# EAGLE schematic Domino Single Ethernet No Teardrop (EAGLE 6.5.0)
DATABASE: ./../Common/BOM/Domino_DB.txt; DRAWN: M.STEMPIN; REV: C
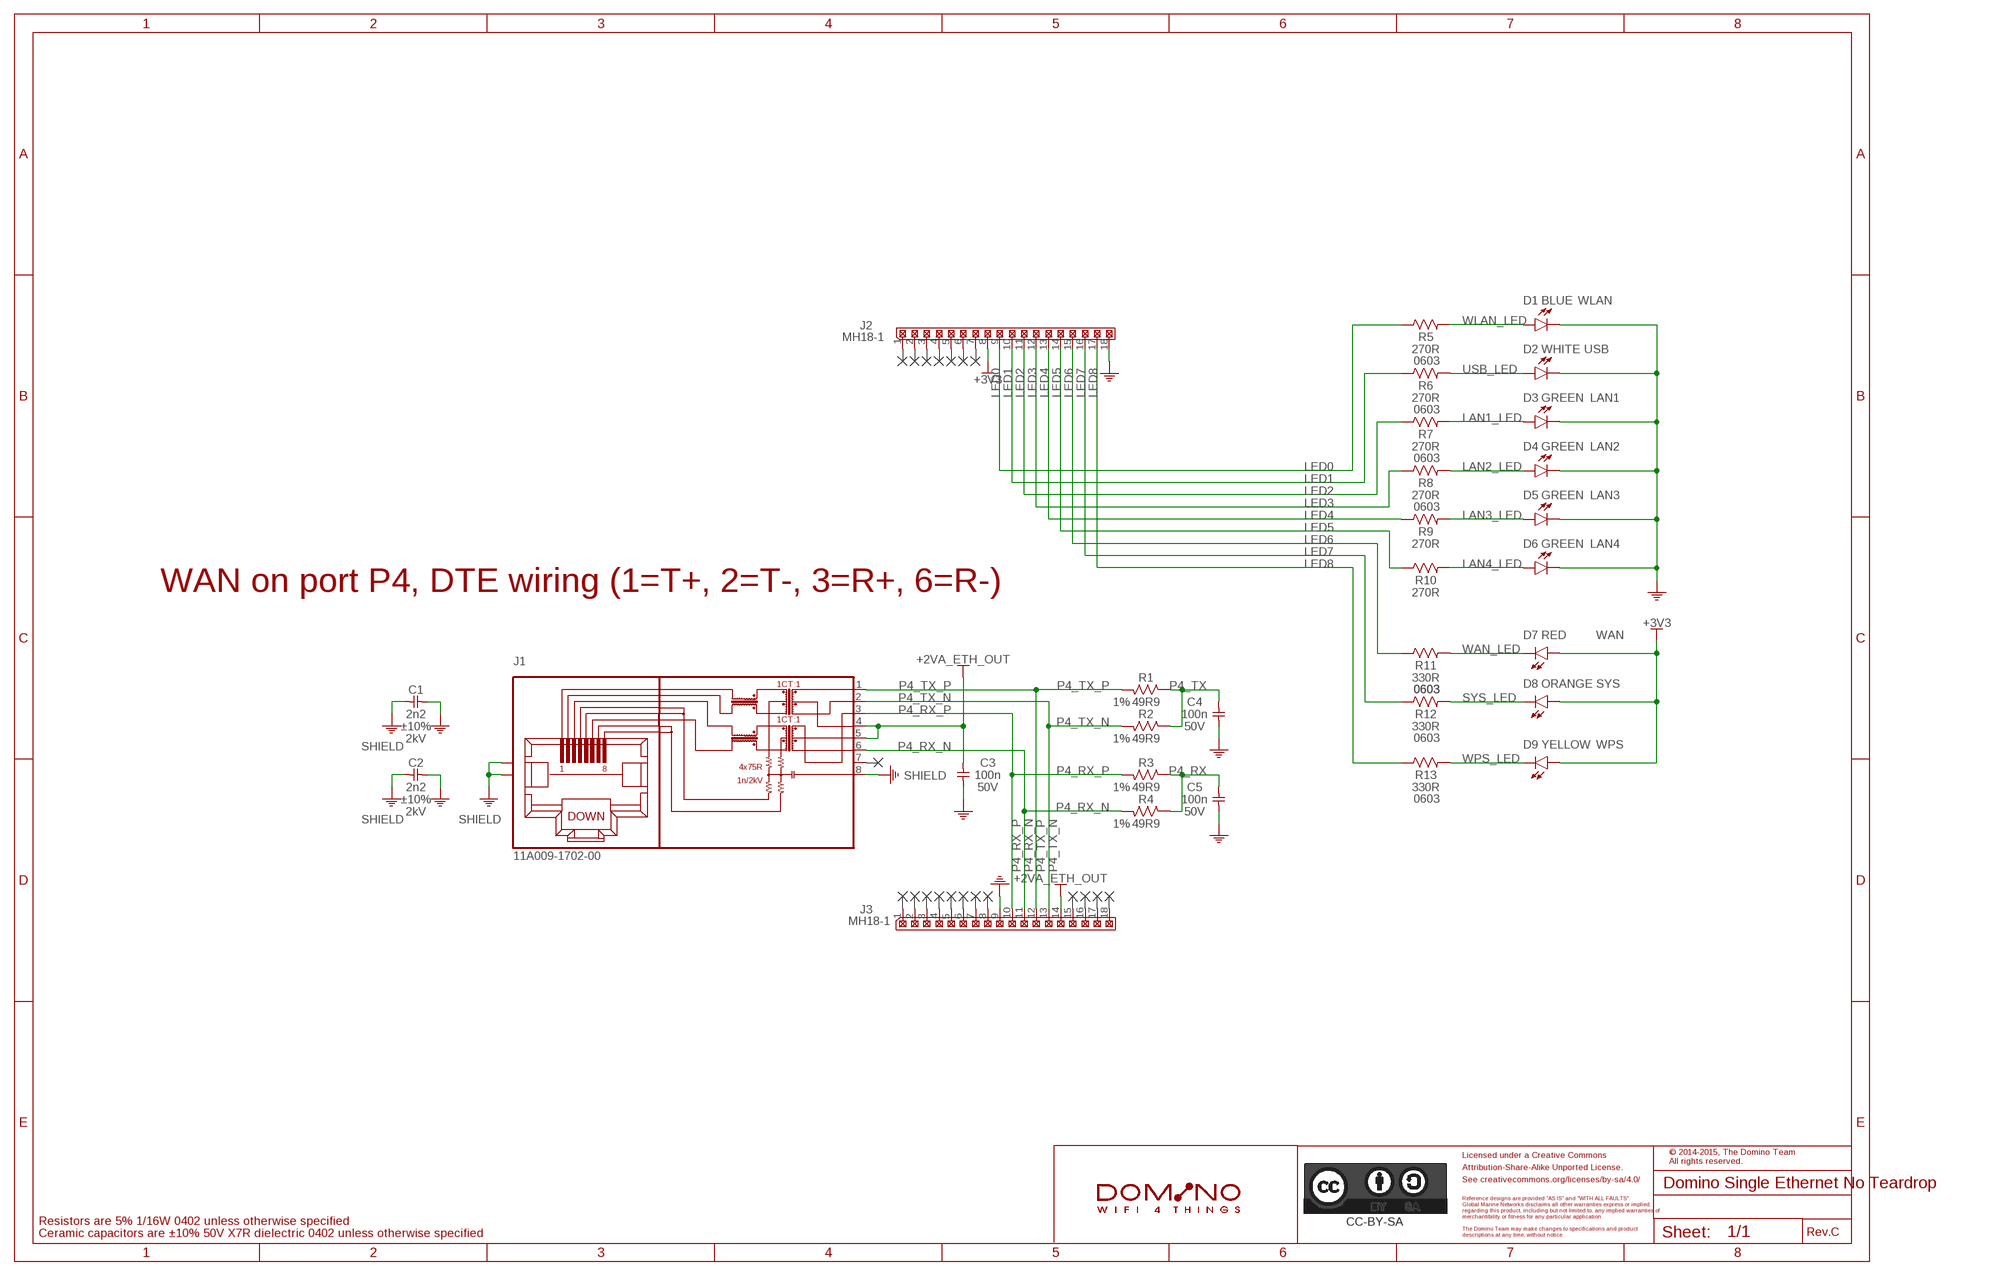
[diagram p0: schematic, sheet 1]
PORT1 (NC): BOM: EXCLUDE
PORT2 (NC): BOM: EXCLUDE
PORT3 (NC): BOM: EXCLUDE
PORT4 (NC): BOM: EXCLUDE
PORT5 (NC): BOM: EXCLUDE
PORT6 (NC): BOM: EXCLUDE
PORT7 (NC): BOM: EXCLUDE
PORT8 (NC): BOM: EXCLUDE
PORT9 (NC): BOM: EXCLUDE
PORT10 (NC): BOM: EXCLUDE
PORT11 (NC): BOM: EXCLUDE
PORT12 (NC): BOM: EXCLUDE
PORT13 (NC): BOM: EXCLUDE
PORT14 (NC): BOM: EXCLUDE
PORT15 (NC): BOM: EXCLUDE
PORT16 (NC): BOM: EXCLUDE
PORT17 (NC): BOM: EXCLUDE
PORT18 (NC): BOM: EXCLUDE
PORT19 (NC): BOM: EXCLUDE
PORT20 (NC): BOM: EXCLUDE

## Parts
C1  2n2  CAP_1206  [C1206]
C2  2n2  CAP_1206  [C1206]
C3  100n  CAP_0402  [C0402]
C4  100n  CAP_0402  [C0402]
C5  100n  CAP_0402  [C0402]
CC-BY-SA1  CC-BY-SA_LOGO  [CC-BY-SA_LOGO]
D1  BLUE  LED_0603  [LED0603]
D2  WHITE  LED_0603  [LED0603]
D3  GREEN  LED_0603  [LED0603]
D4  GREEN  LED_0603  [LED0603]
D5  GREEN  LED_0603  [LED0603]
D6  GREEN  LED_0603  [LED0603]
D7  RED  LED_0603  [LED0603]
D8  ORANGE  LED_0603  [LED0603]
D9  YELLOW  LED_0603  [LED0603]
J1  11A009-1702-00  [11A009-1702-00]
J2  MH18-1  [MH18-1-0.1]
J3  MH18-1  [MH18-1-0.1]
R1  49R9  RES_0402  [R0402]
R2  49R9  RES_0402  [R0402]
R3  49R9  RES_0402  [R0402]
R4  49R9  RES_0402  [R0402]
R5  270R  RES_0603  [R0603]
R6  270R  RES_0603  [R0603]
R7  270R  RES_0603  [R0603]
R8  270R  RES_0603  [R0603]
R9  270R  RES_0603  [R0603]
R10  270R  RES_0603  [R0603]
R11  330R  RES_0603  [R0603]
R12  330R  RES_0603  [R0603]
R13  330R  RES_0603  [R0603]
U$10  DOMINO_LOGO  [DOMINO_LOGO]

## Nets
+2VA_ETH_OUT: C3.2 J1.4 J1.5 J3.14
+3V3: D7.2(A) D8.2(A) D9.2(A) J2.8
GND: C1.1 C2.1 C3.1 C4.1 C5.1 D1.1(C) D2.1(C) D3.1(C) D4.1(C) D5.1(C) D6.1(C) J2.18 J3.9
LAN1_LED: D3.2(A) R7.2
LAN2_LED: D4.2(A) R8.2
LAN3_LED: D5.2(A) R9.2
LAN4_LED: D6.2(A) R10.2
LED0: J2.9 R5.1
LED1: J2.10 R6.1
LED2: J2.11 R7.1
LED3: J2.12 R8.1
LED4: J2.13 R9.1
LED5: J2.14 R10.1
LED6: J2.15 R11.1
LED7: J2.16 R12.1
LED8: J2.17 R13.1
P4_RX: C5.2 R3.1 R4.1
P4_RX_N [Ethernet]: J1.6 J3.11 R4.2
P4_RX_P [Ethernet]: J1.3 J3.10 R3.2
P4_TX: C4.2 R1.1 R2.1
P4_TX_N [Ethernet]: J1.2 J3.13 R2.2
P4_TX_P [Ethernet]: J1.1 J3.12 R1.2
SHIELD: C1.2 C2.2 J1.8 J1.SH$1(SHIELD) J1.SH$2(SHIELD)
SYS_LED: D8.1(C) R12.2
USB_LED: D2.2(A) R6.2
WAN_LED: D7.1(C) R11.2
WLAN_LED: D1.2(A) R5.2
WPS_LED: D9.1(C) R13.2
Unconnected: J1.7 J2.1 J2.2 J2.3 J2.4 J2.5 J2.6 J2.7 J3.1 J3.2 J3.3 J3.4 J3.5 J3.6 J3.7 J3.8 J3.15 J3.16 J3.17 J3.18

## Notes on the sheet
- WLAN
- USB
- LAN1
- LAN2
- LAN3
- LAN4
- WAN on port P4, DTE wiring (1=T+, 2=T-, 3=R+, 6=R-)
- WAN
- SYS
- WPS
- Licensed under a Creative Commons
- © 2014-2015, The Domino Team
  All rights reserved.
- Attribution-Share-Alike Unported License.
- See creativecommons.org/licenses/by-sa/4.0/
- Reference designs are provided "AS IS" and "WITH ALL FAULTS".
- Global Marine Networks disclaims all other warranties express or implied,
- regarding this product, including but not limited to, any implied warranties of
- merchantibility or fitness for any particular application.
- Resistors are 5% 1/16W 0402 unless otherwise specified
- The Domino Team may make changes to specifications and product
- Ceramic capacitors are ±10% 50V X7R dielectric 0402 unless otherwise specified | descriptions at any time, without notice. | Rev.

## Library data of the parts
C1 C2 = Domino:CAP_: Capacitor; PARTNO: C1210_2n2_X7R_10%_CER_2kV; SIZE: 1206; TC: X7R; TOL: ±10%; TYPE: CER; VOLT: 2kV
C3-C5 = Domino:CAP_: Capacitor; PARTNO: C0402_100n_X7R_10%_CER_50V; SIZE: 0402; TC: X7R; TOL: ±10%; TYPE: CER; VOLT: 50V
CC-BY-SA1 = Domino:CC-BY-SA_LOGO: Attribution-Share-Alike Unported License See creativecommons.org/licenses/by-sa/3.0/ for details.; BOM: EXCLUDE
D1 = Domino:LED_: LED; PARTNO: LED0603-BLUE
D2 = Domino:LED_: LED; PARTNO: LED0603-WHITE
D3-D6 = Domino:LED_: LED; PARTNO: LED0603-GREEN
D7 D8 = Domino:LED_: LED; PARTNO: LED0603-ORANGE
D9 = Domino:LED_: LED; PARTNO: LED0603-YELLOW
J1 = Domino:11A009-1702-00: Single Port RJ45 Modular Jack with Integrated Magnetics, no LED, 2 Shield Tabs; PARTNO: 11A009-1702-00
J2 J3 = Domino:MH18-1: 18x1 Pin Male Header; PARTNO: MH18-1-0.1
R1-R4 = Domino:RES_: Resistor; PARTNO: R0402_49R9_1%_62.5mW; RATE: 62.5mW; SIZE: 0402; TOL: 1%
R5-R10 = Domino:RES_: Resistor; PARTNO: R0603_270R_5%_125mW; RATE: 125mW; SIZE: 0603; TOL: 5%
R11-R13 = Domino:RES_: Resistor; PARTNO: R0603_330R_5%_125mW; RATE: 125mW; SIZE: 0603; TOL: 5%
U$10 = Domino:DOMINO_LOGO: Domino Logo; BOM: EXCLUDE

## Net classes
1 Ethernet: width 0.254 mm, clearance 0.152 mm to class 0, clearance 0.152 mm
2 PoE: width 0.457 mm, clearance 0.254 mm to class 0, clearance 0.254 mm to class 1, clearance 0.254 mm